# Altium project 7841R_IDC_RS50_AIO.PrjPcb
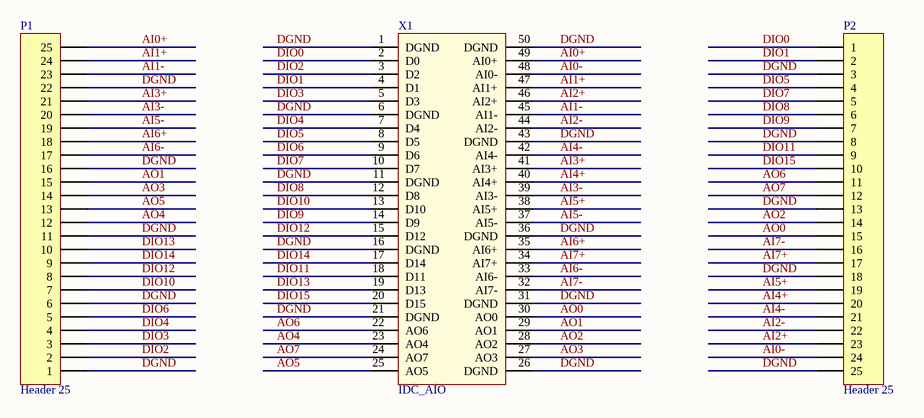
[diagram p0: AIO_Sheet1.SchDoc]
1 sheet, 3 parts. Net scope: global (net labels, ports and power ports of the same name join across sheets).
Board file: AIO.PcbDoc

## Sheet AIO_Sheet1.SchDoc
size A4; SheetNumber: 1; SheetTotal: 1

### Parts
P1  Header 25  [HDR1X25]
P2  Header 25  [HDR1X25]
X1  IDC_AIO  [IDC_AIO]

### Nets
AI0+: P1.25 X1.49(AI0+)
AI0-: P2.24 X1.48(AI0-)
AI1+: P1.24 X1.47(AI1+)
AI1-: P1.23 X1.45(AI1-)
AI2+: P2.23 X1.46(AI2+)
AI2-: P2.22 X1.44(AI2-)
AI3+: P1.21 X1.41(AI3+)
AI3-: P1.20 X1.39(AI3-)
AI4+: P2.20 X1.40(AI4+)
AI4-: P2.21 X1.42(AI4-)
AI5+: P2.19 X1.38(AI5+)
AI5-: P1.19 X1.37(AI5-)
AI6+: P1.18 X1.35(AI6+)
AI6-: P1.17 X1.33(AI6-)
AI7+: P2.17 X1.34(AI7+)
AI7-: P2.16 X1.32(AI7-)
AO0: P2.15 X1.30(AO0)
AO1: P1.15 X1.29(AO1)
AO2: P2.14 X1.28(AO2)
AO3: P1.14 X1.27(AO3)
AO4: P1.12 X1.23(AO4)
AO5: P1.13 X1.25(AO5)
AO6: P2.11 X1.22(AO6)
AO7: P2.12 X1.24(AO7)
DGND: P1.1 P1.6 P1.11 P1.16 P1.22 P2.3 P2.8 P2.13 P2.18 P2.25 X1.1(DGND) X1.6(DGND) X1.11(DGND) X1.16(DGND) X1.21(DGND) X1.26(DGND) X1.31(DGND) X1.36(DGND) X1.43(DGND) X1.50(DGND)
DIO0: P2.1 X1.2(D0)
DIO1: P2.2 X1.4(D1)
DIO2: P1.2 X1.3(D2)
DIO3: P1.3 X1.5(D3)
DIO4: P1.4 X1.7(D4)
DIO5: P2.4 X1.8(D5)
DIO6: P1.5 X1.9(D6)
DIO7: P2.5 X1.10(D7)
DIO8: P2.6 X1.12(D8)
DIO9: P2.7 X1.14(D9)
DIO10: P1.7 X1.13(D10)
DIO11: P2.9 X1.18(D11)
DIO12: P1.8 X1.15(D12)
DIO13: P1.10 X1.19(D13)
DIO14: P1.9 X1.17(D14)
DIO15: P2.10 X1.20(D15)

### Library data of the parts
P1 P2 = Header 25: Header, 25-Pin; LatestRevisionDate: 17-Jul-2002; LatestRevisionNote: Re-released for DXP Platform.; Publisher: Altium Limited